# Altium project llrf_afe.PrjPcb (part 1 of 4)
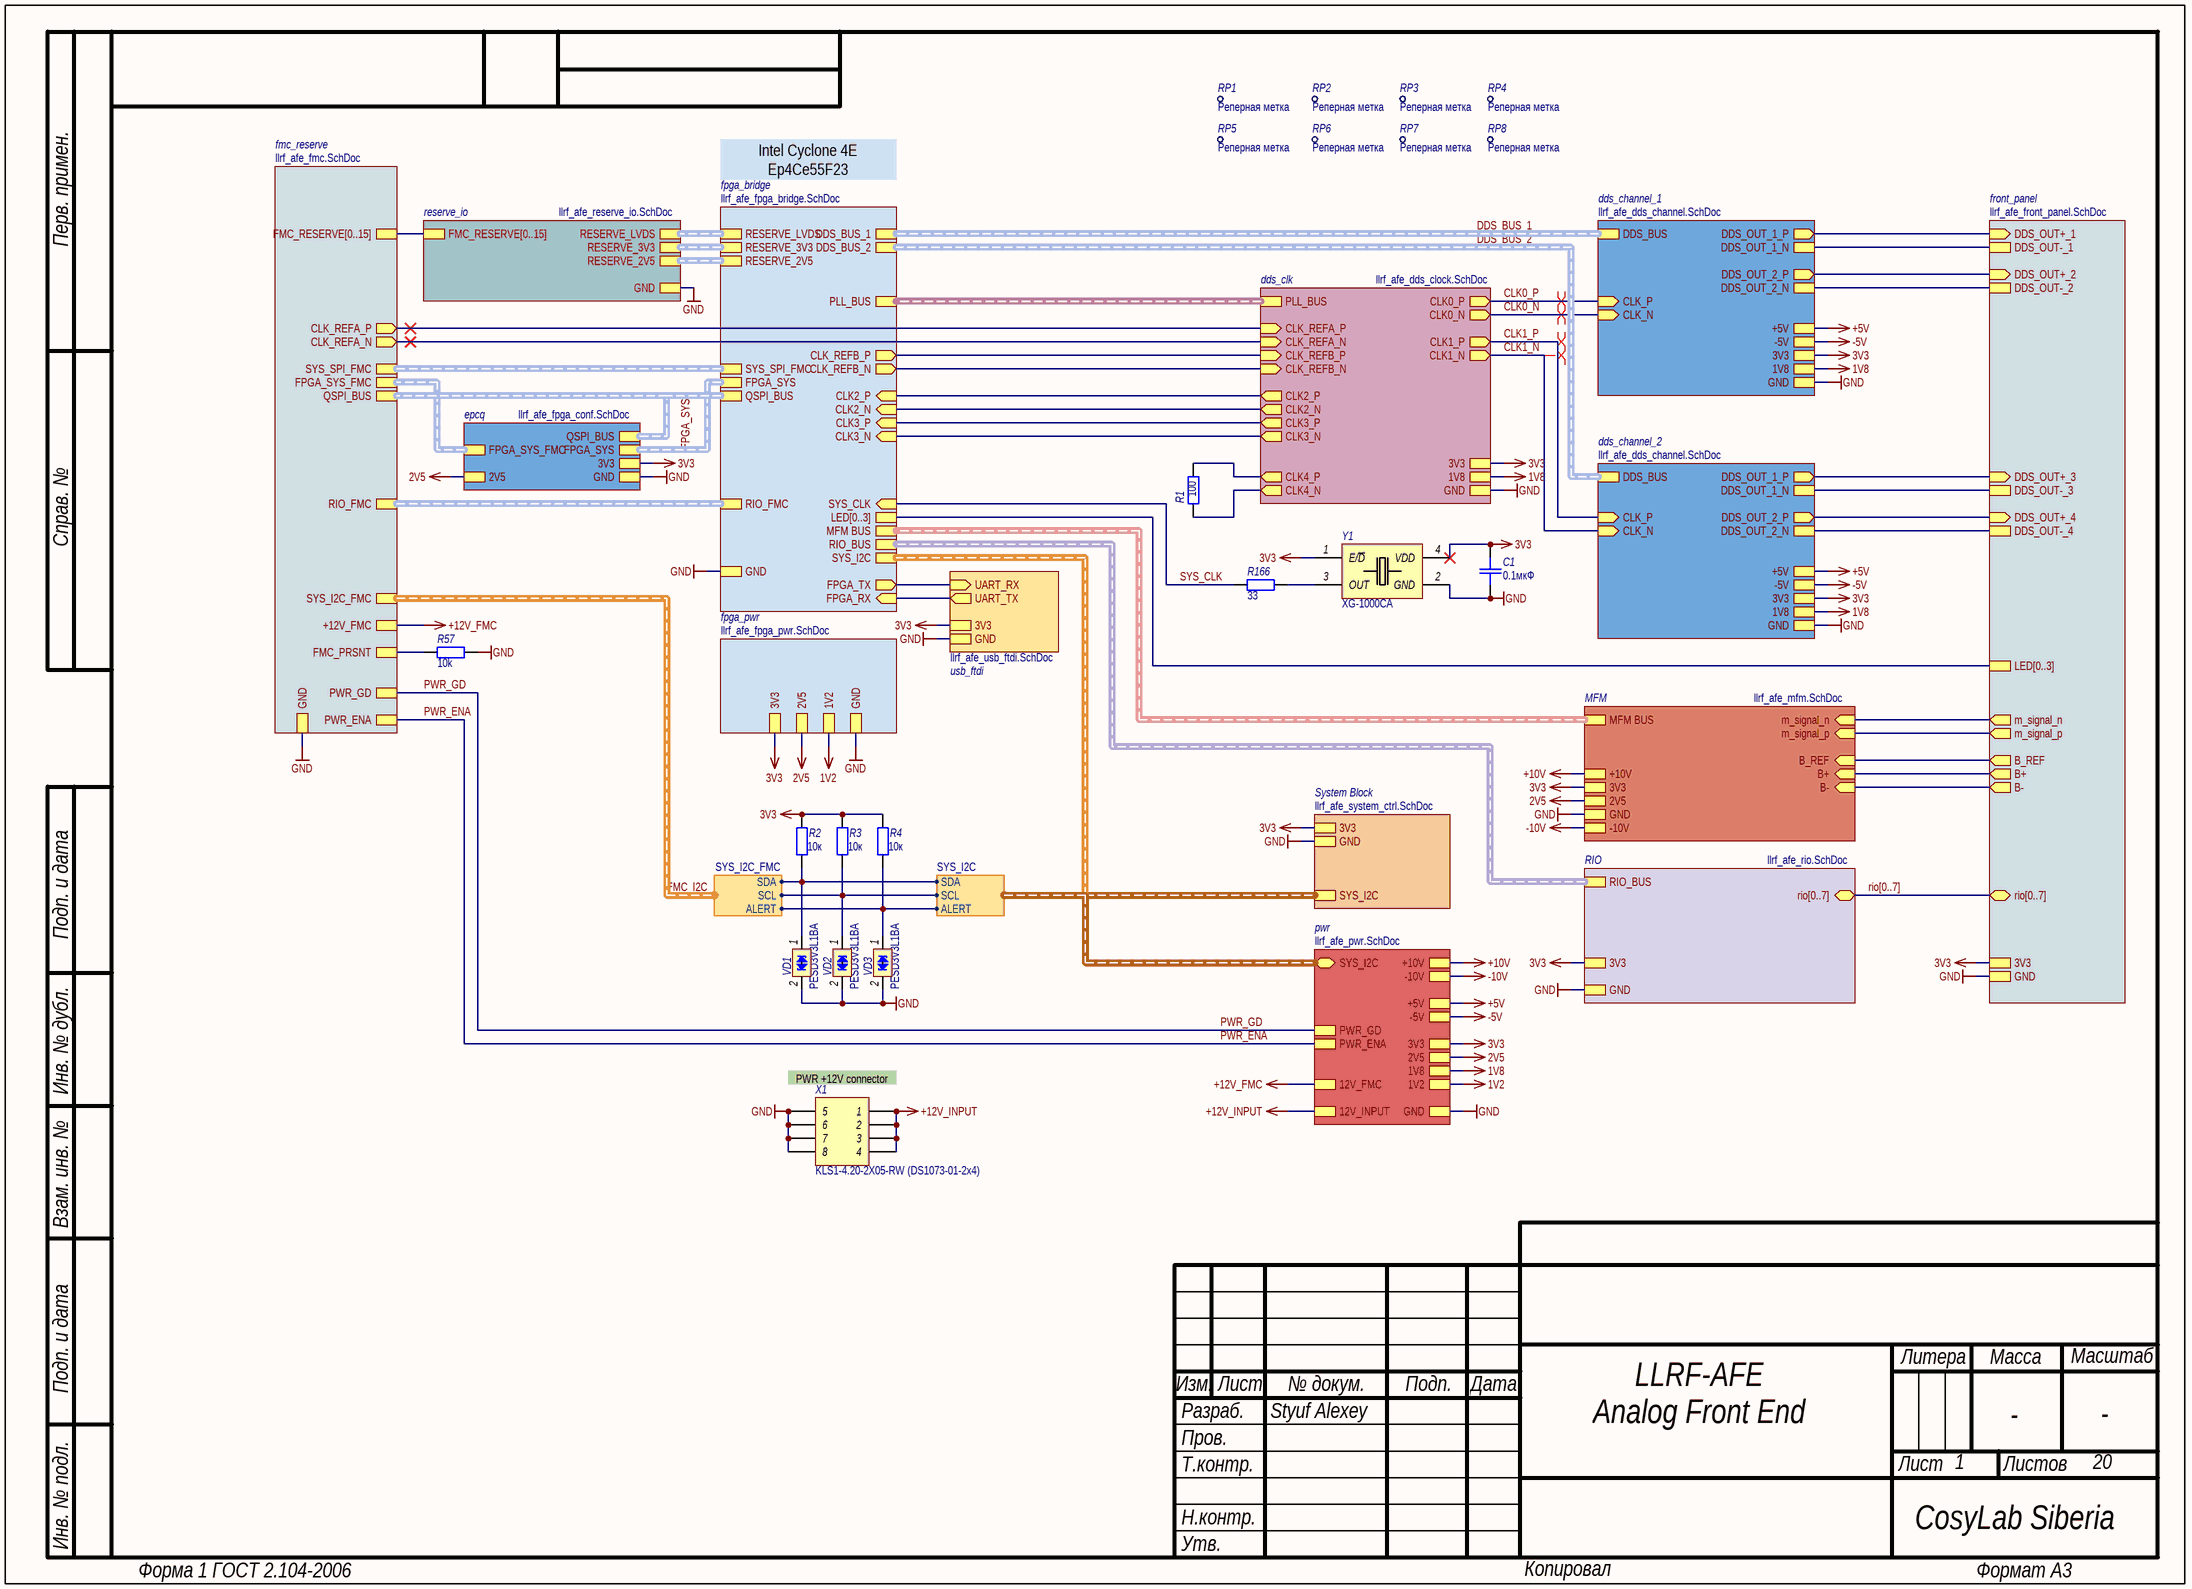
[diagram p0: llrf_afe_main.SchDoc]
Разработал: Styuf Alexey; GlobalProjectRevision: v0.8; GlobalProjectName2: Analog Front End; GlobalProjectName1: LLRF-AFE; GlobalOrganizationName: CosyLab Siberia
20 sheets, 930 parts. Net scope: strictly hierarchical (ports join the sheet entries above them; power ports are local).
Board file: llrf_afe.PcbDoc
Sheets:
  llrf_afe_main.SchDoc
    MFM = llrf_afe_mfm.SchDoc
      mfm_rio = llrf_afe_mfm_rio.SchDoc
    RIO = llrf_afe_rio.SchDoc
      llrf_rio_ch0 = llrf_afe_rio_channel.SchDoc
      llrf_rio_ch1 = llrf_afe_rio_channel.SchDoc
      llrf_rio_ch2 = llrf_afe_rio_channel.SchDoc
      llrf_rio_ch3 = llrf_afe_rio_channel.SchDoc
      llrf_rio_ch4 = llrf_afe_rio_channel.SchDoc
      llrf_rio_ch5 = llrf_afe_rio_channel.SchDoc
      llrf_rio_ch6 = llrf_afe_rio_channel.SchDoc
      llrf_rio_ch7 = llrf_afe_rio_channel.SchDoc
    System Block = llrf_afe_system_ctrl.SchDoc
    fpga_bridge = llrf_afe_fpga_bridge.SchDoc
    front_panel = llrf_afe_front_panel.SchDoc
    dds_clk = llrf_afe_dds_clock.SchDoc
    pwr = llrf_afe_pwr.SchDoc
      3V3_pwr = llrf_afe_pwr_single_ch.SchDoc
      2V5_pwr = llrf_afe_pwr_single_ch.SchDoc
      1V8_pwr = llrf_afe_pwr_single_ch.SchDoc
      3V3_ctrl = llrf_afe_pwr_ctrl.SchDoc
      2V5_ctrl = llrf_afe_pwr_ctrl.SchDoc
      1V8_ctrl = llrf_afe_pwr_ctrl.SchDoc
      12V_ctrl = llrf_afe_pwr_ctrl.SchDoc
      1V2_pwr = llrf_afe_pwr_single_ch.SchDoc
      1V2_ctrl = llrf_afe_pwr_ctrl.SchDoc
      pwr_input = llrf_afe_pwr_input.SchDoc
    fpga_pwr = llrf_afe_fpga_pwr.SchDoc
    usb_ftdi = llrf_afe_usb_ftdi.SchDoc
    epcq = llrf_afe_fpga_conf.SchDoc
    reserve_io = llrf_afe_reserve_io.SchDoc
    dds_channel_1 = llrf_afe_dds_channel.SchDoc
      dds_filter_1 = llrf_afe_dds_filter.SchDoc
      dds_filter_2 = llrf_afe_dds_filter.SchDoc
    dds_channel_2 = llrf_afe_dds_channel.SchDoc
      dds_filter_1 = llrf_afe_dds_filter.SchDoc
      dds_filter_2 = llrf_afe_dds_filter.SchDoc
    fmc_reserve = llrf_afe_fmc.SchDoc

## Sheet llrf_afe_main.SchDoc: =GlobalProjectName
size 410 x 297 mm; Author: Styuf Alexey; Organization: CosyLab Siberia; Revision: v0.8; SheetNumber: 1; SheetTotal: 20; PageSetup: Record=PageOptions|CenterHorizontal=True|CenterVertical=True|PrintScale=1.00|XCorrection=1.00|YCorrection=1.00|PrintKind=1|BorderSize=5000000|LeftOffset=0|BottomOffset=0|Orientation=2|PaperLength=1000|PaperWidth=1000|Scale=100|PaperSource=15|PrintQuality=1200|MediaType=1|DitherType=10|PaperKind=A3|PrintScaleMode=1; Weight: -; ScaleFactor: -

### Parts
C1  0.1мкФ  [SMD_C0402]
R1  100  [SMD_0603]
R2  10к  [SMD_0603]
R3  10к  [SMD_0603]
R4  10к  [SMD_0603]
R57  10k  [SMD_0603]
R166  33  [SMD_0603]
RP1  Наименование: Реперная метка  [ReperPoint]  (hidden comment: RP)
RP2  Наименование: Реперная метка  [ReperPoint]  (hidden comment: RP)
RP3  Наименование: Реперная метка  [ReperPoint]  (hidden comment: RP)
RP4  Наименование: Реперная метка  [ReperPoint]  (hidden comment: RP)
RP5  Наименование: Реперная метка  [ReperPoint]  (hidden comment: RP)
RP6  Наименование: Реперная метка  [ReperPoint]  (hidden comment: RP)
RP7  Наименование: Реперная метка  [ReperPoint]  (hidden comment: RP)
RP8  Наименование: Реперная метка  [ReperPoint]  (hidden comment: RP)
VD1  Наименование: PESD3V3L1BA  [SOD-323]  (hidden comment: PESD3V3)
VD2  Наименование: PESD3V3L1BA  [SOD-323]  (hidden comment: PESD3V3)
VD3  Наименование: PESD3V3L1BA  [SOD-323]  (hidden comment: PESD3V3)
X1  Наименование: KLS1-4.20-2X05-RW (DS1073-01-2x4)  [KLS1-4.20-2X04]  (hidden comment: KLS1-4.20-2X05-R (DS1073-01-2x4))
Y1  XG-1000CA  [SMD_7050_Crystal_Oscillator]

### Sub-sheets
dds_channel_1 = llrf_afe_dds_channel.SchDoc: DDS_OUT_1_N, DDS_BUS (harness DDS_BUS), 3V3, +5V, GND, DDS_OUT_2_P (out), -5V, 1V8, CLK_P (in), DDS_OUT_1_P (out), CLK_N (in), DDS_OUT_2_N
dds_channel_2 = llrf_afe_dds_channel.SchDoc: DDS_OUT_1_N, DDS_BUS (harness SYS_I2C), 3V3, +5V, DDS_OUT_2_P (out), -5V, 1V8, CLK_P (in), CLK_N (in), DDS_OUT_2_N, GND, DDS_OUT_1_P (out)
dds_clk = llrf_afe_dds_clock.SchDoc: CLK1_P (out), CLK1_N (out), CLK3_P (out), CLK3_N (out), CLK0_N (out), CLK0_P (out), PLL_BUS (harness SYS_I2C), 3V3, GND, 1V8, CLK4_P (out), CLK4_N (out), CLK_REFA_N (in), CLK_REFA_P (in), CLK_REFB_P (in), CLK_REFB_N (in), CLK2_P (out), CLK2_N (out)
epcq = llrf_afe_fpga_conf.SchDoc: QSPI_BUS (harness QSPI_BUS), 3V3, GND, FPGA_SYS (harness FPGA_SYS_FMC), FPGA_SYS_FMC (harness FPGA_SYS_FMC), 2V5
fmc_reserve = llrf_afe_fmc.SchDoc: CLK_REFA_N (out), CLK_REFA_P (out), SYS_I2C_FMC (harness SYS_I2C_FMC), +12V_FMC, PWR_GD, PWR_ENA, QSPI_BUS (harness QSPI_BUS), RIO_FMC (harness RIO_FMC), FMC_RESERVE[0..15], SYS_SPI_FMC (harness SYS_SPI_FMC), FPGA_SYS_FMC (harness FPGA_SYS_FMC), GND, FMC_PRSNT
fpga_bridge = llrf_afe_fpga_bridge.SchDoc: MFM BUS (harness SYS_I2C), PLL_BUS (harness SYS_I2C), RIO_BUS (harness SYS_I2C), SYS_I2C (harness SYS_I2C), SYS_SPI_FMC (harness SYS_SPI_FMC), RESERVE_LVDS (harness RESERVE_LVDS), RESERVE_3V3 (harness RESERVE_3V3), RESERVE_2V5 (harness RESERVE_2V5), QSPI_BUS (harness QSPI_BUS), FPGA_SYS (harness FPGA_SYS), RIO_FMC (harness RIO_FMC), DDS_BUS_2 (harness SYS_I2C), DDS_BUS_1, CLK_REFB_N (out), CLK_REFB_P (out), CLK2_P (in), CLK2_N (in), CLK3_N (in), CLK3_P (in), SYS_CLK (in), FPGA_TX (out), FPGA_RX (in), GND, LED[0..3]
fpga_pwr = llrf_afe_fpga_pwr.SchDoc: GND, 2V5, 1V2, 3V3
front_panel = llrf_afe_front_panel.SchDoc: DDS_OUT+_1 (in), DDS_OUT-_1, DDS_OUT+_2 (in), DDS_OUT-_2, m_signal_n (out), m_signal_p (out), B_REF (out), B+ (out), B- (out), rio[0..7] (bidir), DDS_OUT+_3 (in), DDS_OUT-_3, DDS_OUT+_4 (in), DDS_OUT-_4, GND, 3V3, LED[0..3]
MFM = llrf_afe_mfm.SchDoc: m_signal_n (in), MFM BUS (harness SYS_I2C), m_signal_p (in), 2V5, +10V, GND, 3V3, -10V, B+ (in), B- (in), B_REF (in)
pwr = llrf_afe_pwr.SchDoc: 1V8, 2V5, 3V3, +5V, -5V, GND, 1V2, -10V, +10V, 12V_INPUT, SYS_I2C (bidir, harness SYS_I2C), 12V_FMC, PWR_ENA, PWR_GD
reserve_io = llrf_afe_reserve_io.SchDoc: FMC_RESERVE[0..15], RESERVE_LVDS, RESERVE_3V3, RESERVE_2V5, GND
RIO = llrf_afe_rio.SchDoc: RIO_BUS (harness SYS_I2C), 3V3, GND, rio[0..7] (bidir)
System Block = llrf_afe_system_ctrl.SchDoc: SYS_I2C (harness SYS_I2C), 3V3, GND
usb_ftdi = llrf_afe_usb_ftdi.SchDoc: UART_TX (out), UART_RX (in), GND, 3V3

### Harnesses
SYS_I2C_FMC: SDA, SCL, ALERT
SYS_I2C: SDA, SCL, ALERT

### Nets
1V2: sheet pwr/1V2, sheet fpga_pwr/1V2
1V8: sheet dds_clk/1V8, sheet pwr/1V8, sheet dds_channel_1/1V8, sheet dds_channel_2/1V8
2V5: sheet MFM/2V5, sheet pwr/2V5, sheet fpga_pwr/2V5, sheet epcq/2V5
3V3: C1.2 R2.2 R3.2 R4.2 Y1.1(E/~{D}) Y1.4(VDD) ; sheet MFM/3V3, sheet RIO/3V3, sheet System Block/3V3, sheet front_panel/3V3, sheet dds_clk/3V3, sheet pwr/3V3, sheet fpga_pwr/3V3, sheet usb_ftdi/3V3, sheet epcq/3V3, sheet dds_channel_1/3V3, sheet dds_channel_2/3V3
+5V: sheet pwr/+5V, sheet dds_channel_1/+5V, sheet dds_channel_2/+5V
+10V: sheet MFM/+10V, sheet pwr/+10V
+12V_FMC: sheet pwr/12V_FMC, sheet fmc_reserve/+12V_FMC
+12V_INPUT: X1.1 X1.2 X1.3 X1.4 ; sheet pwr/12V_INPUT
-5V: sheet pwr/-5V, sheet dds_channel_1/-5V, sheet dds_channel_2/-5V
-10V: sheet MFM/-10V, sheet pwr/-10V
GND: C1.1 R57.1 VD1.2(cathode_2) VD2.2(cathode_2) VD3.2(cathode_2) X1.5 X1.6 X1.7 X1.8 Y1.2(GND) ; sheet MFM/GND, sheet RIO/GND, sheet System Block/GND, sheet fpga_bridge/GND, sheet front_panel/GND, sheet dds_clk/GND, sheet pwr/GND, sheet fpga_pwr/GND, sheet usb_ftdi/GND, sheet epcq/GND, sheet reserve_io/GND, sheet dds_channel_1/GND, sheet dds_channel_2/GND, sheet fmc_reserve/GND
B+: sheet MFM/B+, sheet front_panel/B+
B-: sheet MFM/B-, sheet front_panel/B-
B_REF: sheet MFM/B_REF, sheet front_panel/B_REF
CLK0_N: sheet dds_clk/CLK0_N, sheet dds_channel_1/CLK_N
CLK0_P: sheet dds_clk/CLK0_P, sheet dds_channel_1/CLK_P
CLK1_N: sheet dds_clk/CLK1_N, sheet dds_channel_2/CLK_N
CLK1_P: sheet dds_clk/CLK1_P, sheet dds_channel_2/CLK_P
CLK2_N: sheet fpga_bridge/CLK2_N, sheet dds_clk/CLK2_N
CLK2_P: sheet fpga_bridge/CLK2_P, sheet dds_clk/CLK2_P
CLK3_N: sheet fpga_bridge/CLK3_N, sheet dds_clk/CLK3_N
CLK3_P: sheet fpga_bridge/CLK3_P, sheet dds_clk/CLK3_P
CLK4_N: R1.1 ; sheet dds_clk/CLK4_N
CLK4_P: R1.2 ; sheet dds_clk/CLK4_P
CLK_REFB_N: sheet fpga_bridge/CLK_REFB_N, sheet dds_clk/CLK_REFB_N
CLK_REFB_P: sheet fpga_bridge/CLK_REFB_P, sheet dds_clk/CLK_REFB_P
DDS_OUT+_1: sheet front_panel/DDS_OUT+_1, sheet dds_channel_1/DDS_OUT_1_P
DDS_OUT+_2: sheet front_panel/DDS_OUT+_2, sheet dds_channel_1/DDS_OUT_2_P
DDS_OUT+_3: sheet front_panel/DDS_OUT+_3, sheet dds_channel_2/DDS_OUT_1_P
DDS_OUT+_4: sheet front_panel/DDS_OUT+_4, sheet dds_channel_2/DDS_OUT_2_P
DDS_OUT-_1: sheet front_panel/DDS_OUT-_1, sheet dds_channel_1/DDS_OUT_1_N
DDS_OUT-_2: sheet front_panel/DDS_OUT-_2, sheet dds_channel_1/DDS_OUT_2_N
DDS_OUT-_3: sheet front_panel/DDS_OUT-_3, sheet dds_channel_2/DDS_OUT_1_N
DDS_OUT-_4: sheet front_panel/DDS_OUT-_4, sheet dds_channel_2/DDS_OUT_2_N
FMC_I2C.ALERT: R4.1 VD3.1(cathode_1) ; sheet fmc_reserve/SYS_I2C_FMC.ALERT, sheet System Block/SYS_I2C.ALERT
FMC_I2C.SCL: R3.1 VD2.1(cathode_1) ; sheet fmc_reserve/SYS_I2C_FMC.SCL, sheet System Block/SYS_I2C.SCL
FMC_I2C.SDA: R2.1 VD1.1(cathode_1) ; sheet fmc_reserve/SYS_I2C_FMC.SDA, sheet System Block/SYS_I2C.SDA
FMC_PRSNT: R57.2 ; sheet fmc_reserve/FMC_PRSNT
FPGA_RX: sheet fpga_bridge/FPGA_RX, sheet usb_ftdi/UART_TX
FPGA_TX: sheet fpga_bridge/FPGA_TX, sheet usb_ftdi/UART_RX
m_signal_n: sheet MFM/m_signal_n, sheet front_panel/m_signal_n
m_signal_p: sheet MFM/m_signal_p, sheet front_panel/m_signal_p
PWR_ENA: sheet pwr/PWR_ENA, sheet fmc_reserve/PWR_ENA
PWR_GD: sheet pwr/PWR_GD, sheet fmc_reserve/PWR_GD
REFA_N: sheet dds_clk/CLK_REFA_N, sheet fmc_reserve/CLK_REFA_N
REFA_P: sheet dds_clk/CLK_REFA_P, sheet fmc_reserve/CLK_REFA_P
SYS_CLK: R166.2 ; sheet fpga_bridge/SYS_CLK
NetR166_1: R166.1 Y1.3(OUT)

### Buses and harness runs
bus rio[0..7] = sheet front_panel/rio[0..7] = sheet RIO/rio[0..7]
bus sheet fmc_reserve/FMC_RESERVE[0..15] = sheet reserve_io/FMC_RESERVE[0..15]
bus sheet fpga_bridge/LED[0..3] = sheet front_panel/LED[0..3]
harness DDS_BUS_1 = sheet dds_channel_1/DDS_BUS = sheet fpga_bridge/DDS_BUS_1
harness DDS_BUS_2 = sheet dds_channel_2/DDS_BUS = sheet fpga_bridge/DDS_BUS_2
harness FMC_I2C = sheet fmc_reserve/SYS_I2C_FMC
harness FPGA_SYS = sheet epcq/FPGA_SYS = sheet fpga_bridge/FPGA_SYS
harness sheet dds_clk/PLL_BUS = sheet fpga_bridge/PLL_BUS
harness sheet epcq/FPGA_SYS_FMC = sheet fmc_reserve/FPGA_SYS_FMC
harness sheet epcq/QSPI_BUS = sheet fmc_reserve/QSPI_BUS = sheet fpga_bridge/QSPI_BUS
harness sheet fmc_reserve/RIO_FMC = sheet fpga_bridge/RIO_FMC
harness sheet fmc_reserve/SYS_SPI_FMC = sheet fpga_bridge/SYS_SPI_FMC
harness sheet fpga_bridge/MFM BUS = sheet MFM/MFM BUS
harness sheet fpga_bridge/RESERVE_2V5 = sheet reserve_io/RESERVE_2V5
harness sheet fpga_bridge/RESERVE_3V3 = sheet reserve_io/RESERVE_3V3
harness sheet fpga_bridge/RESERVE_LVDS = sheet reserve_io/RESERVE_LVDS
harness sheet fpga_bridge/RIO_BUS = sheet RIO/RIO_BUS
harness sheet fpga_bridge/SYS_I2C = sheet pwr/SYS_I2C = sheet System Block/SYS_I2C

### Layout directives
differential pair: CLK0_N, CLK0_P, CLK1_N, CLK1_P

### Notes on the sheet
- Intel Cyclone 4E
  Ep4Ce55F23
- (near X1) PWR +12V connector
- Перв. примен.
- Справ. №
- Подп. и дата
- Инв. № дубл.
- Взам. инв. №
- Изм.
- Разраб.
- Лист
- № докум.
- Подп.
- Дата
- Литера
- Масса
- Масштаб
- Пров.
- Т.контр.
- Листов
- Н.контр.
- Утв.
- Инв. № подл.
- Форма 1 ГОСТ 2.104-2006
- Копировал
- Формат А3

### Library data of the parts
C1 = Capacitor: Назначение: SMD-конденсатор; Наименование: Конденсатор; Потребление, Вт: 0; Точность: %; Напряжение: В; Value: 0.1мкФ; Диэлектрик: *
R1-R4 R57 R166 = Resistor: Наименование: Резистор; Назначение: SMD-резистор; Потребление, Вт: 0,001
  R1: Value: 100
  R2-R4: Value: 10к
  R57: Value: 10k
  R166: Value: 33
RP1-RP8 = RP: Назначение: реперная метка для автоматического монтажа
VD1-VD3 = PESDxL1BA: Low capacitance bidirectional ESD protection diodes; Назначение: ESD защитные диоды; Потребление, Вт: 0.0; ComponentLink1Description: DataSheet; ComponentLink1URL: https://static.chipdip.ru/lib/635/DOC005635911.pdf
X1 = KLS1-4.20-2X05-R: Вилка на плату угловая 4.2мм 8pin со втулками (дополнительное питание PCIe); Потребление, Вт: 0,000; Назначение: Вилка на плату угловая 4.2мм 8pin со втулками; ComponentLink1Description: DataSheet; ComponentLink1URL: https://img80002547.weyesimg.com/uploads/www.klselectronic.com/addon/15632682388191.pdf
Y1 = Crystal_Oscillator: Crystall oscillator, CMOS, 3.3V, SMD7050; Назначение: Crystall oscillator, CMOS, 3.3V, SMD7050, 100 МГц; Потребление, Вт: 0.12; ComponentLink1Description: DataSheet; ComponentLink1URL: https://ru.mouser.com/datasheet/2/137/G_1000CA_en-1003255.pdf; Наименование: XG-1000CA

## Sheet llrf_afe_mfm.SchDoc: =GlobalProjectName
size 209 x 297 mm; Author: Styuf Alexey; Organization: CosyLab Siberia; Revision: v0.8; SheetNumber: 3; SheetTotal: 17; PageSetup: Record=PageOptions|CenterHorizontal=True|CenterVertical=True|PrintScale=1.00|XCorrection=1.00|YCorrection=1.00|PrintKind=1|BorderSize=5000000|LeftOffset=0|BottomOffset=0|Orientation=2|PaperLength=1000|PaperWidth=1000|Scale=100|PaperSource=15|PrintQuality=1200|MediaType=1|DitherType=10|PaperKind=A3|PrintScaleMode=1; Weight: -; ScaleFactor: -
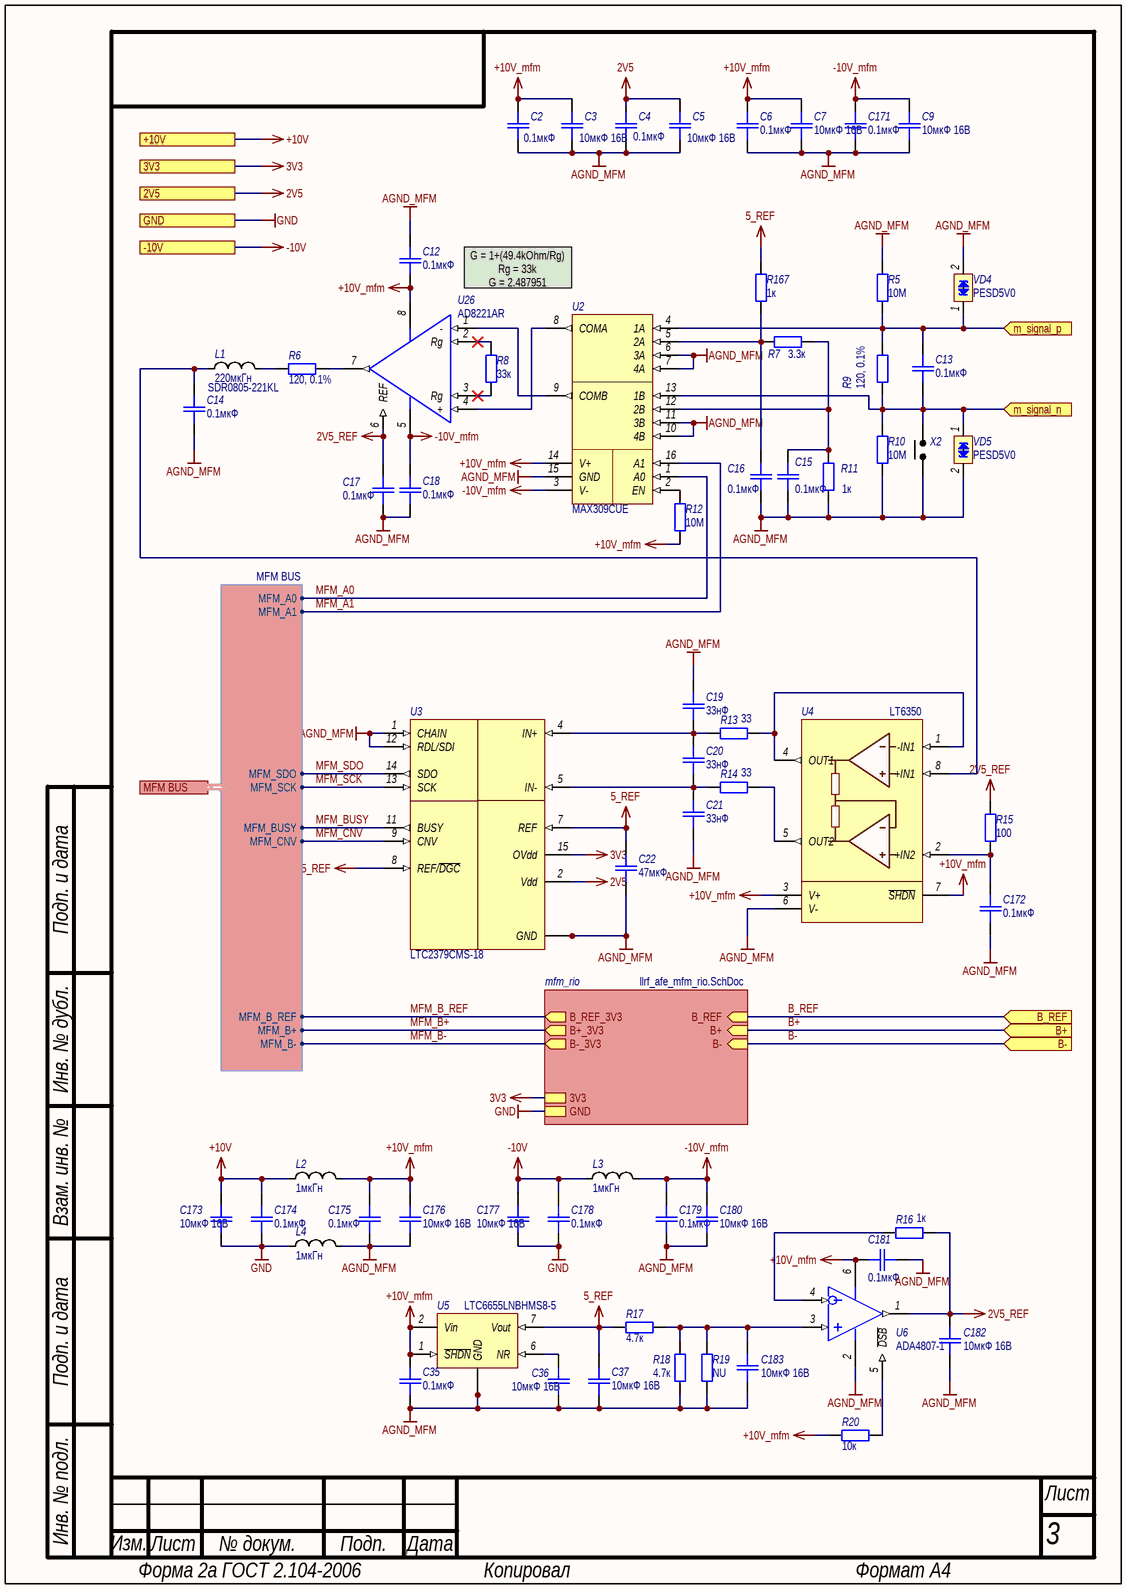
[diagram p1: llrf_afe_mfm.SchDoc]

### Parts
C2  0.1мкФ  [SMD_C0402]
C3  10мкФ 16В  [SMD_C0603]
C4  0.1мкФ  [SMD_C0402]
C5  10мкФ 16В  [SMD_C0603]
C6  0.1мкФ  [SMD_C0402]
C7  10мкФ 16В  [SMD_C0603]
C9  10мкФ 16В  [SMD_C0603]
C12  0.1мкФ  [SMD_C0402]
C13  0.1мкФ  [SMD_C0402]
C14  0.1мкФ  [SMD_C0603]
C15  0.1мкФ  [SMD_C0402]
C16  0.1мкФ  [SMD_C0402]
C17  0.1мкФ  [SMD_C0402]
C18  0.1мкФ  [SMD_C0402]
C19  33нФ  [SMD_C0603]
C20  33нФ  [SMD_C0603]
C21  33нФ  [SMD_C0603]
C22  47мкФ  [SMD_C0805]
C35  0.1мкФ  [SMD_C0402]
C36  10мкФ 16В  [SMD_C0603]
C37  10мкФ 16В  [SMD_C0603]
C171  0.1мкФ  [SMD_C0402]
C172  0.1мкФ  [SMD_C0402]
C173  10мкФ 16В  [SMD_C0603]
C174  0.1мкФ  [SMD_C0402]
C175  0.1мкФ  [SMD_C0402]
C176  10мкФ 16В  [SMD_C0603]
C177  10мкФ 16В  [SMD_C0603]
C178  0.1мкФ  [SMD_C0402]
C179  0.1мкФ  [SMD_C0402]
C180  10мкФ 16В  [SMD_C0603]
C181  0.1мкФ  [SMD_C0402]
C182  10мкФ 16В  [SMD_C0603]
C183  10мкФ 16В  [SMD_C0603]
L1  220мкГн  Наименование: SDR0805-221KL  [SDR0805]
L2  1мкГн  [SMD_0805]
L3  1мкГн  [SMD_0805]
L4  1мкГн  [SMD_0805]
R5  10M  [SMD_0603]
R6  120, 0.1%  [SMD_0603]
R7  3.3к  [SMD_0603]
R8  33к  [SMD_0603]
R9  120, 0.1%  [SMD_0603]
R10  10M  [SMD_0603]
R11  1к  [SMD_0603]
R12  10M  [SMD_0603]
R13  33  [SMD_0603]
R14  33  [SMD_0603]
R15  100  [SMD_0603]
R16  1к  [SMD_0603]
R17  4.7к  [SMD_0603]
R18  4.7к  [SMD_0603]
R19  NU  [SMD_0603]
R20  10к  [SMD_0603]
R167  1к  [SMD_0603]
U2  MAX309CUE  [TSSOP-16N]
U3  Наименование: LTC2379CMS-18  [MSOP16]  (hidden comment: LTC2739)
U4  LT6350  [MSOP-8]
U5  Наименование: LTC6655LNBHMS8-5  [MSOP-8]  (hidden comment: LTC6655LN)
U6  ADA4807-1  [SOT23-6]
U26  Наименование: AD8221AR  [SOIC-8]  (hidden comment: AD8221)
VD4  PESD5V0  [SOD-323]
VD5  PESD5V0  [SOD-323]
X2  Jumper 2  [PLS-2]  (value not drawn)

### Sub-sheets
mfm_rio = llrf_afe_mfm_rio.SchDoc: 3V3, GND, B_REF_3V3 (out), B- (in), B+ (in), B_REF (in), B+_3V3 (out), B-_3V3 (out)

### Ports
2V5, 3V3, +10V, -10V, B+ (in), B- (in), B_REF (in), GND, m_signal_n (in), m_signal_p (in), MFM BUS (harness MFM BUS)

### Harnesses
MFM BUS: MFM_A0, MFM_A1, MFM_SDO, MFM_SCK, MFM_BUSY, MFM_CNV, MFM_B_REF, MFM_B+, MFM_B-

### Nets
2V5: C4.2 C5.2 U3.2(Vdd) ; port 2V5
2V5_REF: C17.2 C182.2 R15.2 R16.1 U6.1(OUT) U26.6(REF)
3V3: U3.15(OVdd) ; port 3V3, sheet mfm_rio/3V3
5_REF: C22.2 C37.2 R17.2 R167.1 U3.7(REF) U3.8(REF/~{DGC}) U5.7(Vout)
+10V: C173.2 C174.2 L2.1 ; port +10V
+10V_mfm: C2.2 C3.2 C6.2 C7.2 C12.2 C35.2 C175.2 C176.2 C181.2 L2.2 R12.1 R20.1 U2.14(V+) U4.3(V+) U4.7(~{SHDN}) U5.1(~{SHDN}) U5.2(Vin) U6.6(V+) U26.8(V+)
-10V: C177.2 C178.2 L3.1 ; port -10V
-10V_mfm: C9.2 C18.2 C171.2 C179.2 C180.2 L3.2 U2.3(V-) U26.5(V-)
AGND_MFM: C2.1 C3.1 C4.1 C5.1 C6.1 C7.1 C9.1 C12.1 C14.1 C15.1 C16.1 C17.1 C18.1 C19.2 C21.1 C22.1 C35.1 C36.1 C37.1 C171.1 C172.1 C175.1 C176.1 C179.1 C180.1 C181.1 C182.1 C183.1 L4.2 R5.2 R10.1 R11.2 R18.2 R19.2 U2.6(3A) U2.7(4A) U2.10(4B) U2.11(3B) U2.15(GND) U3.1(CHAIN) U3.3(GND) U3.6(GND) U3.10(GND) U3.12(RDL/SDI) U3.16(GND) U4.6(V-) U5.3(GND) U5.4(GND) U5.5(GND) U5.8(GND) U6.2(V-) VD4.2(cathode_2) VD5.2(cathode_2) X2.1
GND: C173.1 C174.1 C177.1 C178.1 L4.1 ; port GND, sheet mfm_rio/GND
B+: port B+, sheet mfm_rio/B+
B-: port B-, sheet mfm_rio/B-
B_REF: port B_REF, sheet mfm_rio/B_REF
m_signal_n: C13.1 R9.1 R10.2 U2.13(1B) VD5.1(cathode_1) X2.2 ; port m_signal_n
m_signal_p: C13.2 R5.1 R9.2 U2.4(1A) VD4.1(cathode_1) ; port m_signal_p
MFM_A0: U2.1(A0) ; port MFM BUS.MFM_A0
MFM_A1: U2.16(A1) ; port MFM BUS.MFM_A1
MFM_B+: sheet mfm_rio/B+_3V3, port MFM BUS.MFM_B+
MFM_B-: sheet mfm_rio/B-_3V3, port MFM BUS.MFM_B-
MFM_B_REF: sheet mfm_rio/B_REF_3V3, port MFM BUS.MFM_B_REF
MFM_BUSY: U3.11(BUSY) ; port MFM BUS.MFM_BUSY
MFM_CNV: U3.9(CNV) ; port MFM BUS.MFM_CNV
MFM_SCK: U3.13(SCK) ; port MFM BUS.MFM_SCK
MFM_SDO: U3.14(SDO) ; port MFM BUS.MFM_SDO
NetC14_2: C14.2 L1.1 U4.8(+IN1)
NetC15_2: C15.2 R7.2 R11.1 U2.12(2B)
NetC16_2: C16.2 R7.1 R167.2 U2.5(2A)
NetC19_1: C19.1 C20.2 R13.2 U3.4(IN+)
NetC20_1: C20.1 C21.2 R14.2 U3.5(IN-)
NetC36_2: C36.2 U5.6(NR)
NetC172_2: C172.2 R15.1 U4.2(+IN2)
NetC183_2: C183.2 R17.1 R18.1 R19.1 U6.3(IN+)
NetL1_2: L1.2 R6.2
NetR6_1: R6.1 U26.7(OUT)
NetR8_1: R8.1 U26.3(Rg)
NetR8_2: R8.2 U26.2(Rg)
NetR12_2: R12.2 U2.2(EN)
NetR13_1: R13.1 U4.1(-IN1) U4.4(OUT1)
NetR14_1: R14.1 U4.5(OUT2)
NetR16_2: R16.2 U6.4(IN-)
NetR20_2: R20.2 U6.5(~{DSB})
NetU2_8: U2.8(COMA) U26.4(+)
NetU2_9: U2.9(COMB) U26.1(-)

### Notes on the sheet
- G = 1+(49.4kOhm/Rg)
  Rg = 33k
  G = 2.487951
- Подп. и дата
- Инв. № дубл.
- Взам. инв. №
- Инв. № подл.
- Изм.
- Лист
- № докум.
- Подп.
- Дата
- Форма 2а ГОСТ 2.104-2006
- Копировал
- Формат А4

### Library data of the parts
C2-C7 C9 C12-C22 C35-C37 C171-C183 = Capacitor: Назначение: SMD-конденсатор; Наименование: Конденсатор; Потребление, Вт: 0
  C2 C4 C6 C12-C18 C35 C171 C172 C174 C175 C178 C179 C181: Value: 0.1мкФ
  C3 C5 C7 C9 C36 C37 C173 C176 C177 C180 C182 C183: Value: 10мкФ 16В
  C19-C21: Value: 33нФ
  C22: Value: 47мкФ
L1 = Inductor: Назначение: SMD-индуктивность; Потребление, Вт: 0,010; Value: 220мкГн
L2-L4 = Inductor: Наименование: Индуктивность; Назначение: SMD-индуктивность; Потребление, Вт: 0,010; Value: 1мкГн
R5-R20 R167 = Resistor: as R1 on sheet llrf_afe_main
  R5 R10 R12: Value: 10M
  R6 R9: Value: 120, 0.1%
  R7: Value: 3.3к
  R8: Value: 33к
  R11 R16 R167: Value: 1к
  R13 R14: Value: 33
  R15: Value: 100
  R17 R18: Value: 4.7к
  R19: Value: NU
  R20: Value: 10к
U2 = MAX309CUE: Precision, 8-Channel/Dual 4-Channel, / High-Performance, CMOS Analog Multiplexers; Назначение: Аналоговый двухканальный мультиплексор; Потребление, Вт: 0,001; Наименование: MAX309CUE; ComponentLink1Description: DataSheet; ComponentLink1URL: https://datasheets.maximintegrated.com/en/ds/MAX308-MAX309.pdf
U3 = LTC2739: 18-Bit, 1.6Msps, Low Power SAR ADC with 101.2dB SNR; Потребление, Вт: 0,025; Назначение: 18-Bit, 1.6Msps, Low Power SAR ADC with 101.2dB SNR; ComponentLink1Description: DataSheet; ComponentLink1URL: https://www.analog.com/media/en/technical-documentation/data-sheets/237918fb.pdf
U4 = LT6350: Single-Ended to Differential Converter/ADC Driver, Rail-to-Rail; Наименование: LT6350CMS8; Потребление, Вт: 0,05; Назначение: Single-Ended to Differential Converter/ADC Driver; ComponentLink1Description: DataSheet; ComponentLink1URL: https://www.analog.com/media/en/technical-documentation/data-sheets/6350fc.pdf
U5 = LTC6655LN: 0.25ppm Noise, Low Drift Precision References; Потребление, Вт: 0,005; Назначение: 0.25ppm Noise, Low Drift Precision References; ComponentLink1Description: DataSheet; ComponentLink1URL: https://www.analog.com/media/en/technical-documentation/data-sheets/ltc6655-6655ln.pdf
U6 = ADA4807-1: Rail-to-Rail Input/Output Amplifiers, 3.1 nV/√Hz, 1 mA, 180 MHz; Потребление, Вт: 0,01; Назначение: Rail-to-Rail Input/Output Amplifiers, 3.1 nV/√Hz, 1 mA, 180 MHz; ComponentLink1Description: DataSheet; ComponentLink1URL: https://www.analog.com/media/en/technical-documentation/data-sheets/ADA4807-1_4807-2_4807-4.pdf; Supplier 1: Digi-Key; Supplier Part Number 1: ADA4807-1AKSZ-R2CT-ND; Наименование: ADA4807-1
U26 = AD8221: Precision Instrumentation Amplifier; Потребление, Вт: 0.01; Назначение: Precision Instrumentation Amplifier; ComponentLink1Description: DataSheet; ComponentLink1URL: https://www.analog.com/media/en/technical-documentation/data-sheets/AD8221.pdf
VD4 VD5 = PESDxL1BA: as VD1 on sheet llrf_afe_main; Наименование: PESDxL1BA; ComponentLink1Description: DataSheet; ComponentLink1URL: https://static.chipdip.ru/lib/635/DOC005635911.pdf
X2 = Jumper 2: Jumper, 2-Pin, Dual row; Потребление, Вт: 0,0; Наименование: Jumper 2-pin; Назначение: Jumper, 2-Pin, Dual row

## Sheet llrf_afe_mfm_rio.SchDoc: =GlobalProjectName
size 209 x 297 mm; Author: Styuf Alexey; Organization: CosyLab Siberia; Revision: v0.8; SheetNumber: 15; SheetTotal: 17; PageSetup: Record=PageOptions|CenterHorizontal=True|CenterVertical=True|PrintScale=1.00|XCorrection=1.00|YCorrection=1.00|PrintKind=1|BorderSize=5000000|LeftOffset=0|BottomOffset=0|Orientation=2|PaperLength=1000|PaperWidth=1000|Scale=100|PaperSource=15|PrintQuality=1200|MediaType=1|DitherType=10|PaperKind=A3|PrintScaleMode=1; Weight: -; ScaleFactor: -
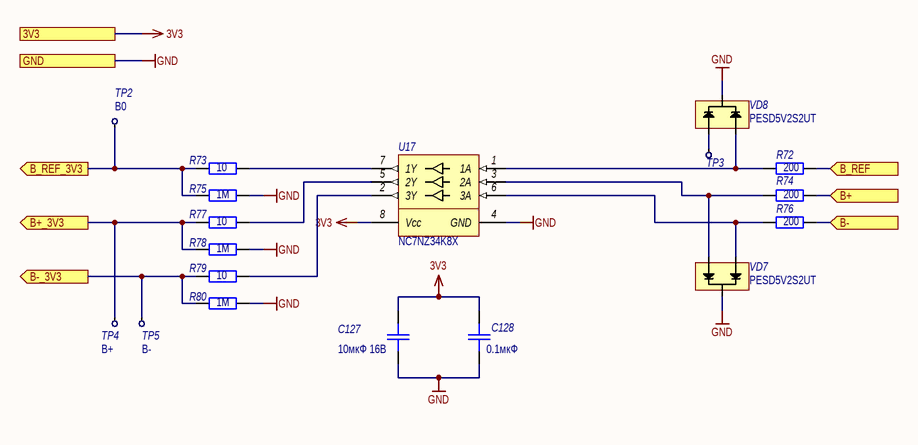
[diagram p2: llrf_afe_mfm_rio.SchDoc]

### Parts
C127  10мкФ 16В  [SMD_C0603]
C128  0.1мкФ  [SMD_C0402]
R72  200  [SMD_0603]
R73  10  [SMD_0603]
R74  200  [SMD_0603]
R75  1M  [SMD_0603]
R76  200  [SMD_0603]
R77  10  [SMD_0603]
R78  1M  [SMD_0603]
R79  10  [SMD_0603]
R80  1M  [SMD_0603]
TP2  B0  [TestPoint]
TP3  (no value)  [TestPoint]
TP4  B+  [TestPoint]
TP5  B-  [TestPoint]
U17  Наименование: NC7NZ34K8X  [US-8]  (hidden comment: NC7NZ34)
VD7  Наименование: PESD5V2S2UT  [SOT-23]  (hidden comment: PESDxS2UT)
VD8  Наименование: PESD5V2S2UT  [SOT-23]  (hidden comment: PESDxS2UT)

### Ports
3V3, B+ (in), B+_3V3 (out), B- (in), B-_3V3 (out), B_REF (in), B_REF_3V3 (out), GND

### Nets
3V3: C127.2 C128.2 U17.8(Vcc) ; port 3V3
GND: C127.1 C128.1 R75.1 R78.1 R80.1 U17.4(GND) VD7.3(C3) VD8.3(C3) ; port GND
B+: R74.2 ; port B+
B-: R76.2 ; port B-
B_REF: R72.2 ; port B_REF
MFM_B+: R77.1 R78.2 TP4.0(TP) ; port B+_3V3
MFM_B-: R79.1 R80.2 TP5.0(TP) ; port B-_3V3
MFM_B_REF: R73.1 R75.2 TP2.0(TP) ; port B_REF_3V3
NetR72_1: R72.1 U17.1(1A) VD8.1(C1)
NetR73_2: R73.2 U17.7(1Y)
NetR74_1: R74.1 U17.3(2A) VD7.1(C1)
NetR76_1: R76.1 U17.6(3A) VD7.2(C2)
NetR77_2: R77.2 U17.5(2Y)
NetR79_2: R79.2 U17.2(3Y)
NetTP3_0: TP3.0(TP) VD8.2(C2)

### Notes on the sheet
- Подп. и дата
- Инв. № дубл.
- Взам. инв. №
- Инв. № подл.
- Изм.
- Лист
- № докум.
- Подп.
- Дата
- Форма 2а ГОСТ 2.104-2006
- Копировал
- Формат А4

### Library data of the parts
C127 = Capacitor: Назначение: SMD-конденсатор; Наименование: GRM188C81C106MA73; Потребление, Вт: 0; Value: 10мкФ 16В
C128 = Capacitor: as C2 on sheet llrf_afe_mfm; Value: 0.1мкФ
R72-R80 = Resistor: as R1 on sheet llrf_afe_main
  R72 R74 R76: Value: 200
  R73 R77 R79: Value: 10
  R75 R78 R80: Value: 1M
TP2-TP5 = TP: Наименование: Точка проверки; Назначение: Контроль параметров платы
  TP2: TP_Name: B0
  TP4: TP_Name: B+
  TP5: TP_Name: B-
U17 = NC7NZ34: TinyLogic UHS Triple Buffer; Потребление, Вт: 0.01; Назначение: TinyLogic UHS Triple Buffer; ComponentLink1Description: DataSheet; ComponentLink1URL: https://www.onsemi.com/pdf/datasheet/nc7nz34-d.pdf; Supplier 1: Digi-Key; Supplier Part Number 1: NC7NZ34K8XCT-ND
VD7 VD8 = PESDxS2UT: Double ESD protection diodes; Потребление, Вт: 0; Назначение: Double ESD protection diodes; ComponentLink1Description: DataSheet; ComponentLink1URL: https://assets.nexperia.com/documents/data-sheet/PESDXS2UT_SERIES.pdf

## Sheet llrf_afe_rio.SchDoc: =GlobalProjectName
size 209 x 297 mm; Author: Styuf Alexey; Organization: CosyLab Siberia; Revision: v0.8; SheetNumber: 5; SheetTotal: 17; PageSetup: Record=PageOptions|CenterHorizontal=True|CenterVertical=True|PrintScale=1.00|XCorrection=1.00|YCorrection=1.00|PrintKind=1|BorderSize=5000000|LeftOffset=0|BottomOffset=0|Orientation=2|PaperLength=1000|PaperWidth=1000|Scale=100|PaperSource=15|PrintQuality=1200|MediaType=1|DitherType=10|PaperKind=A3|PrintScaleMode=1; Weight: -; ScaleFactor: -
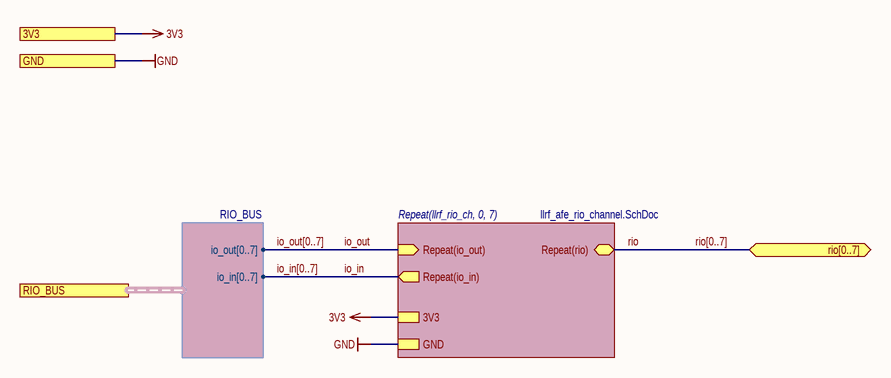
[diagram p3: llrf_afe_rio.SchDoc]

### Sub-sheets
Repeat(llrf_rio_ch, 0, 7) = llrf_afe_rio_channel.SchDoc: Repeat(io_in) (out), GND, Repeat(rio) (bidir), Repeat(io_out) (in), 3V3

### Ports
3V3, GND, rio[0..7] (bidir), RIO_BUS (harness RIO_BUS)

### Harnesses
RIO_BUS: io_out[0..7], io_in[0..7]

### Nets
3V3: port 3V3, sheet Repeat(llrf_rio_ch, 0, 7)/3V3
GND: port GND, sheet Repeat(llrf_rio_ch, 0, 7)/GND
io_in: sheet Repeat(llrf_rio_ch, 0, 7)/Repeat(io_in)
io_out: sheet Repeat(llrf_rio_ch, 0, 7)/Repeat(io_out)
rio: sheet Repeat(llrf_rio_ch, 0, 7)/Repeat(rio)

### Buses and harness runs
bus io_in[0..7]
bus io_out[0..7]
bus rio[0..7] = port rio[0..7]

### Notes on the sheet
- Подп. и дата
- Инв. № дубл.
- Взам. инв. №
- Инв. № подл.
- Изм.
- Лист
- № докум.
- Подп.
- Дата
- Форма 2а ГОСТ 2.104-2006
- Копировал
- Формат А4

## Sheet llrf_afe_rio_channel.SchDoc: =GlobalProjectName
size 209 x 297 mm; Author: Styuf Alexey; Organization: CosyLab Siberia; Revision: v0.8; SheetNumber: 4; SheetTotal: 17; PageSetup: Record=PageOptions|CenterHorizontal=True|CenterVertical=True|PrintScale=1.00|XCorrection=1.00|YCorrection=1.00|PrintKind=1|BorderSize=5000000|LeftOffset=0|BottomOffset=0|Orientation=2|PaperLength=1000|PaperWidth=1000|Scale=100|PaperSource=15|PrintQuality=1200|MediaType=1|DitherType=10|PaperKind=A3|PrintScaleMode=1; Weight: -; ScaleFactor: -
Used 8 times, as channels RIO/llrf_rio_ch0, RIO/llrf_rio_ch1, RIO/llrf_rio_ch2, RIO/llrf_rio_ch3, RIO/llrf_rio_ch4, RIO/llrf_rio_ch5, RIO/llrf_rio_ch6, RIO/llrf_rio_ch7. Parts and nets are listed once, with the designators drawn on the sheet.
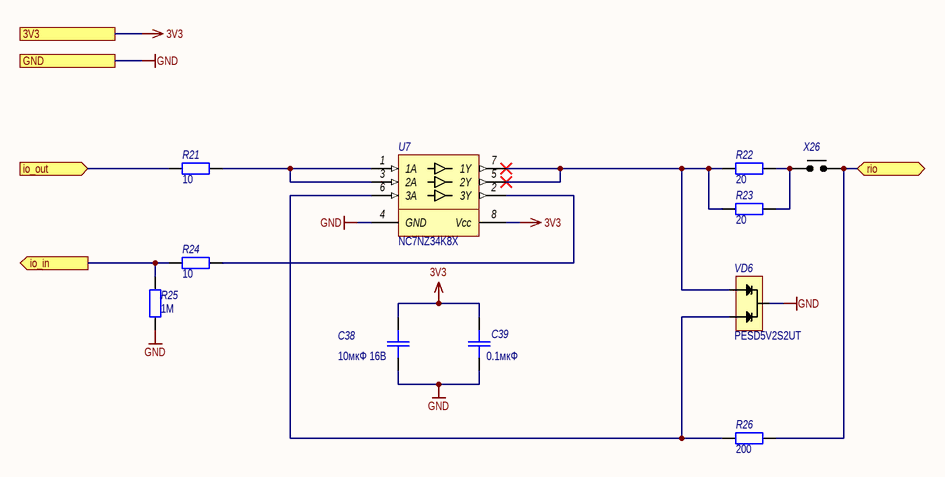
[diagram p4: llrf_afe_rio_channel.SchDoc]

### Parts
C38  10мкФ 16В  [SMD_C0603]
C39  0.1мкФ  [SMD_C0402]
R21  10  [SMD_0603]
R22  20  [SMD_1206]
R23  20  [SMD_1206]
R24  10  [SMD_0603]
R25  1M  [SMD_0603]
R26  200  [SMD_0603]
U7  Наименование: NC7NZ34K8X  [US-8]  (hidden comment: NC7NZ34)
VD6  Наименование: PESD5V2S2UT  [SOT-23]  (hidden comment: PESDxS2UT)
X26  Jumper 2  [PLS-2]  (value not drawn)

### Ports
3V3, GND, io_in (out), io_out (in), rio (bidir)

### Nets
3V3: C38.2 C39.2 U7.8(Vcc) ; port 3V3
GND: C38.1 C39.1 R25.1 U7.4(GND) VD6.3(C3) ; port GND
io_in: R24.1 R25.2 ; port io_in
io_out: R21.1 ; port io_out
rio: R26.2 X26.2 ; port rio
NetR21_2: R21.2 U7.1(1A) U7.3(2A)
NetR22_1: R22.1 R23.1 U7.5(2Y) U7.7(1Y) VD6.1(C1)
NetR22_2: R22.2 R23.2 X26.1
NetR24_2: R24.2 U7.2(3Y)
NetR26_1: R26.1 U7.6(3A) VD6.2(C2)

### Channels
RIO/llrf_rio_ch0: designators end in _llrf_rio_ch0; ports 3V3=3V3 GND=GND io_in=io_in0 io_out=io_out0 rio=rio0
RIO/llrf_rio_ch1: designators end in _llrf_rio_ch1; ports 3V3=3V3 GND=GND io_in=io_in1 io_out=io_out1 rio=rio1
RIO/llrf_rio_ch2: designators end in _llrf_rio_ch2; ports 3V3=3V3 GND=GND io_in=io_in2 io_out=io_out2 rio=rio2
RIO/llrf_rio_ch3: designators end in _llrf_rio_ch3; ports 3V3=3V3 GND=GND io_in=io_in3 io_out=io_out3 rio=rio3
RIO/llrf_rio_ch4: designators end in _llrf_rio_ch4; ports 3V3=3V3 GND=GND io_in=io_in4 io_out=io_out4 rio=rio4
RIO/llrf_rio_ch5: designators end in _llrf_rio_ch5; ports 3V3=3V3 GND=GND io_in=io_in5 io_out=io_out5 rio=rio5
RIO/llrf_rio_ch6: designators end in _llrf_rio_ch6; ports 3V3=3V3 GND=GND io_in=io_in6 io_out=io_out6 rio=rio6
RIO/llrf_rio_ch7: designators end in _llrf_rio_ch7; ports 3V3=3V3 GND=GND io_in=io_in7 io_out=io_out7 rio=rio7

### Notes on the sheet
- Подп. и дата
- Инв. № дубл.
- Взам. инв. №
- Инв. № подл.
- Изм.
- Лист
- № докум.
- Подп.
- Дата
- Форма 2а ГОСТ 2.104-2006
- Копировал
- Формат А4

### Library data of the parts
C38 = Capacitor: as C127 on sheet llrf_afe_mfm_rio; Value: 10мкФ 16В
C39 = Capacitor: as C2 on sheet llrf_afe_mfm; Value: 0.1мкФ
R21-R26 = Resistor: as R1 on sheet llrf_afe_main
  R21 R24: Value: 10
  R22 R23: Value: 20
  R25: Value: 1M
  R26: Value: 200
U7 = NC7NZ34: as U17 on sheet llrf_afe_mfm_rio; Назначение: TinyLogic UHS Triple Buffer; ComponentLink1Description: DataSheet; ComponentLink1URL: https://www.onsemi.com/pdf/datasheet/nc7nz34-d.pdf; Supplier 1: Digi-Key; Supplier Part Number 1: NC7NZ34K8XCT-ND
VD6 = PESDxS2UT: as VD7 on sheet llrf_afe_mfm_rio; Назначение: Double ESD protection diodes; ComponentLink1Description: DataSheet; ComponentLink1URL: https://assets.nexperia.com/documents/data-sheet/PESDXS2UT_SERIES.pdf
X26 = Jumper 2: as X2 on sheet llrf_afe_mfm; Назначение: Jumper, 2-Pin, Dual row

## Sheet llrf_afe_system_ctrl.SchDoc: =GlobalProjectName
size 209 x 297 mm; Author: Styuf Alexey; Organization: CosyLab Siberia; Revision: v0.8; SheetNumber: 14; SheetTotal: 17; PageSetup: Record=PageOptions|CenterHorizontal=True|CenterVertical=True|PrintScale=1.00|XCorrection=1.00|YCorrection=1.00|PrintKind=1|BorderSize=5000000|LeftOffset=0|BottomOffset=0|Orientation=2|PaperLength=1000|PaperWidth=1000|Scale=100|PaperSource=15|PrintQuality=1200|MediaType=1|DitherType=10|PaperKind=A3|PrintScaleMode=1; Weight: -; ScaleFactor: -
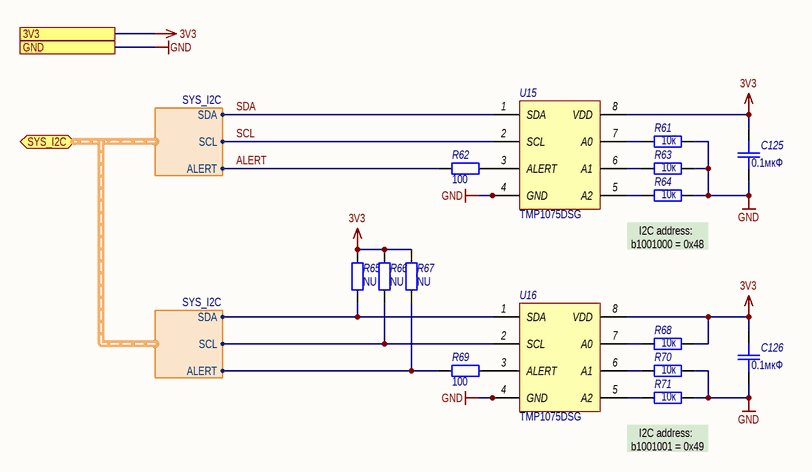
[diagram p5: llrf_afe_system_ctrl.SchDoc]

### Parts
C125  0.1мкФ  [SMD_C0402]
C126  0.1мкФ  [SMD_C0402]
R61  10к  [SMD_0603]
R62  100  [SMD_0603]
R63  10к  [SMD_0603]
R64  10к  [SMD_0603]
R65  NU  [SMD_0603]
R66  NU  [SMD_0603]
R67  NU  [SMD_0603]
R68  10к  [SMD_0603]
R69  100  [SMD_0603]
R70  10к  [SMD_0603]
R71  10к  [SMD_0603]
U15  TMP1075DSG  [WSON-8]
U16  TMP1075DSG  [WSON-8]

### Ports
3V3, GND, SYS_I2C (bidir, harness SYS_I2C)

### Harnesses
SYS_I2C: SDA, SCL, ALERT

### Nets
3V3: C125.2 C126.2 R65.1 R66.1 R67.1 R68.2 U15.8(VDD) U16.8(VDD) ; port 3V3
GND: C125.1 C126.1 R61.2 R63.2 R64.2 R70.2 R71.2 U15.4(GND) U15.9(GND) U16.4(GND) U16.9(GND) ; port GND
ALERT: R62.1 R67.2 R69.1 ; port SYS_I2C.ALERT  [project net FMC_I2C.ALERT]
SCL: R66.2 U15.2(SCL) U16.2(SCL) ; port SYS_I2C.SCL  [project net FMC_I2C.SCL]
SDA: R65.2 U15.1(SDA) U16.1(SDA) ; port SYS_I2C.SDA  [project net FMC_I2C.SDA]
NetR61_1: R61.1 U15.7(A0)
NetR62_2: R62.2 U15.3(ALERT)
NetR63_1: R63.1 U15.6(A1)
NetR64_1: R64.1 U15.5(A2)
NetR68_1: R68.1 U16.7(A0)
NetR69_2: R69.2 U16.3(ALERT)
NetR70_1: R70.1 U16.6(A1)
NetR71_1: R71.1 U16.5(A2)

### Notes on the sheet
- I2C address:
  b1001000 = 0x48
- I2C address:
  b1001001 = 0x49
- Подп. и дата
- Инв. № дубл.
- Взам. инв. №
- Инв. № подл.
- Изм.
- Лист
- № докум.
- Подп.
- Дата
- Форма 2а ГОСТ 2.104-2006
- Копировал
- Формат А4

### Library data of the parts
C125 C126 = Capacitor: as C2 on sheet llrf_afe_mfm; Value: 0.1мкФ
R61-R71 = Resistor: as R1 on sheet llrf_afe_main
  R61 R63 R64 R68 R70 R71: Value: 10к
  R62 R69: Value: 100
  R65-R67: Value: NU
U15 U16 = TMP1075DSG: TMP1075 Temperature Sensor With I2C and SMBus Interface; Назначение: Датчик температуры I2C; Потребление, Вт: 0,001; ComponentLink1Description: DataSheet; ComponentLink1URL: https://www.ti.com/lit/gpn/tmp1075; Наименование: TMP1075DSG